# EAGLE design modem-breakout (EAGLE 9.6.2)
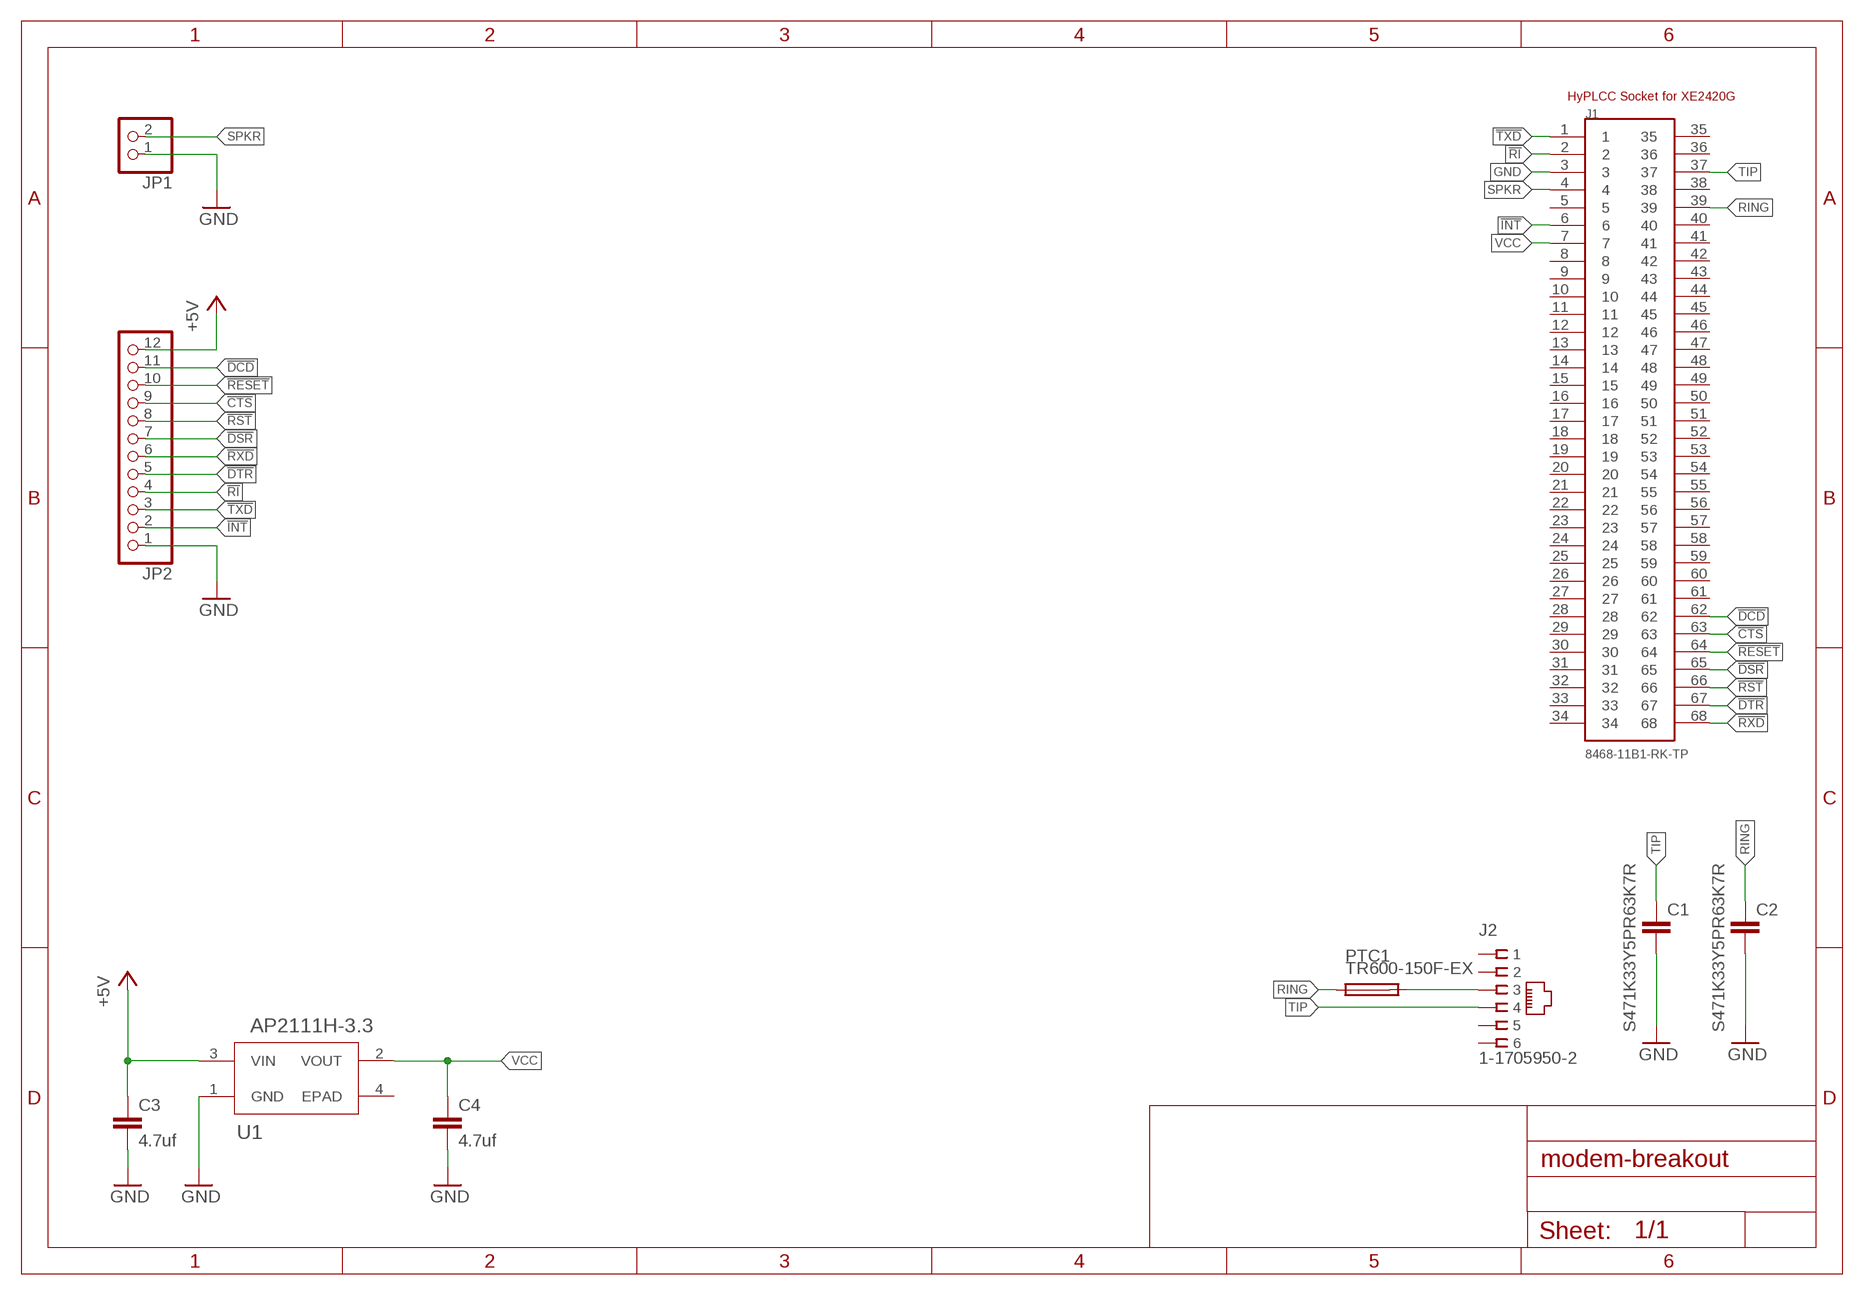
[diagram p0: schematic, sheet 1]

## Parts
C1  S471K33Y5PR63K7R  C-EU075-052X106  [C075-052X106]
C2  S471K33Y5PR63K7R  C-EU075-052X106  [C075-052X106]
C3  4.7uf  C-EUC0805  [C0805]
C4  4.7uf  C-EUC0805  [C0805]
J1  8468-11B1-RK-TP  [3M_8468-11B1-RK-TP]
J2  1-1705950-2  RJ11-2L-B  [RJ11-NO_SHIELD]
JP1  PINHD-1X2  [1X02]
JP2  PINHD-1X12  [1X12]
PTC1  TR600-150F-EX  [13.50X6.00]
U1  AP2111H-3.3  AP2111H-3.3TRG1SOT-223_DIO-M  [SOT-223_DIO-M]

## Nets
!CTS: J1.63 JP2.9
!DCD: J1.62 JP2.11
!DSR: J1.65 JP2.7
!DTR: J1.67 JP2.5
!INT: J1.6 JP2.2
!RESET: J1.64 JP2.10
!RI: J1.2 JP2.4
!RST: J1.66 JP2.8
!RXD: J1.68 JP2.6
!TXD: J1.1 JP2.3
+5V: C3.1 JP2.12 U1.3(VIN)
GND: C1.2 C2.2 C3.2 C4.2 J1.3 JP1.1 JP2.1 U1.1(GND)
N$3: J2.3 PTC1.P$2
RING: C2.1 J1.39 PTC1.P$1
SPKR: J1.4 JP1.2
TIP: C1.1 J1.37 J2.4
VCC: C4.1 J1.7 U1.2(VOUT)
Unconnected: J1.5 J1.8 J1.9 J1.10 J1.11 J1.12 J1.13 J1.14 J1.15 J1.16 J1.17 J1.18 J1.19 J1.20 J1.21 J1.22 J1.23 J1.24 J1.25 J1.26 J1.27 J1.28 J1.29 J1.30 J1.31 J1.32 J1.33 J1.34 J1.35 J1.36 J1.38 J1.40 J1.41 J1.42 J1.43 J1.44 J1.45 J1.46 J1.47 J1.48 J1.49 J1.50 J1.51 J1.52 J1.53 J1.54 J1.55 J1.56 J1.57 J1.58 J1.59 J1.60 J1.61 J2.1 J2.2 J2.5 J2.6 U1.4(EPAD)

## Notes on the sheet
- HyPLCC Socket for XE2420G

## Library data of the parts
C1-C4 = rcl:C-EU: CAPACITOR, European symbol; SPICEPREFIX: C
J1 = 8468-11B1-RK-TP:8468-11B1-RK-TP: PLCC Chip Carrier Socket (Low Profile, 4 Row, Thru-Hole) 68 position Check prices <https://pricing.snapeda.com/parts/8468-11B1-RK-TP/3M/view-part?ref=eda>; AVAILABILITY: In Stock; DESCRIPTION: 68 (4 x 17) Pos PLCC Socket Tin Through Hole; MF: 3M; MP: 8468-11B1-RK-TP; PACKAGE: None; PRICE: None; PURCHASE-URL: https://pricing.snapeda.com/search/part/8468-11B1-RK-TP/?ref=eda
J2 = con-tycoelectronics_copy:RJ11: CORCOM Modular RJ Jacks No Shield Source: www.tycoelectronics.com .. ENG_DS_1654001_1099_RJ_L_0507.pdf; MF: TYCO ELECTRONICS; MPN: RJ11-2L-B; OC_FARNELL: unknown; OC_NEWARK: 83F4463
JP1 = pinhead:PINHD-1X2: PIN HEADER
JP2 = pinhead:PINHD-1X12: PIN HEADER
PTC1 = TR600-150F-EX:TR600-150F-EX
U1 = AP2111H-3.3TRG1:AP2111H-3.3TRG1; BUILT_BY: EMA_UL_Team; MANUFACTURER_PART_NUMBER: AP2111H-3.3TRG1; SOURCELIBRARY: DIODESINC_2_2015-08-18; VENDOR: Diodes Inc

## Board
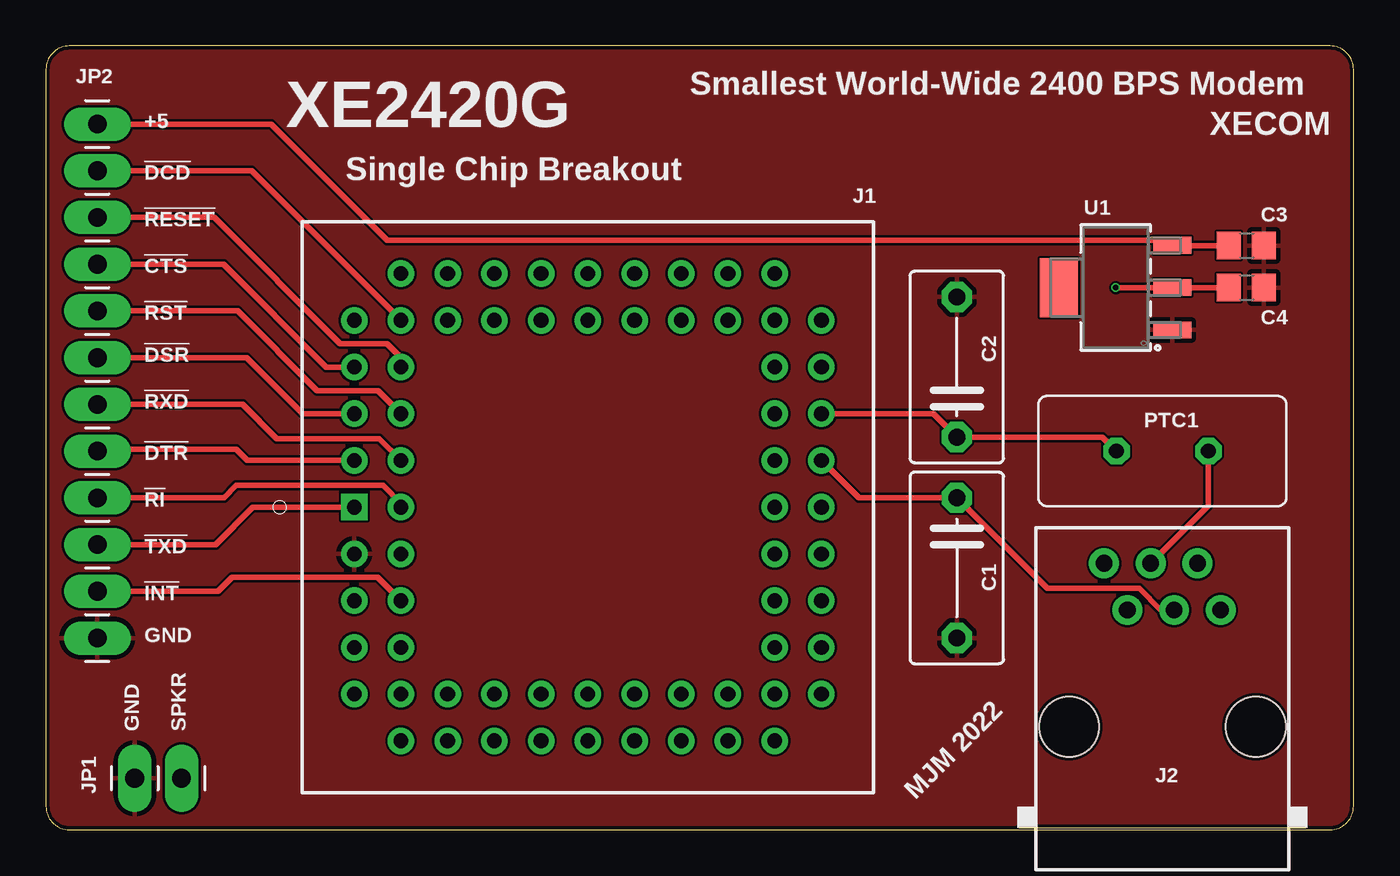
[diagram p1: board, top side]
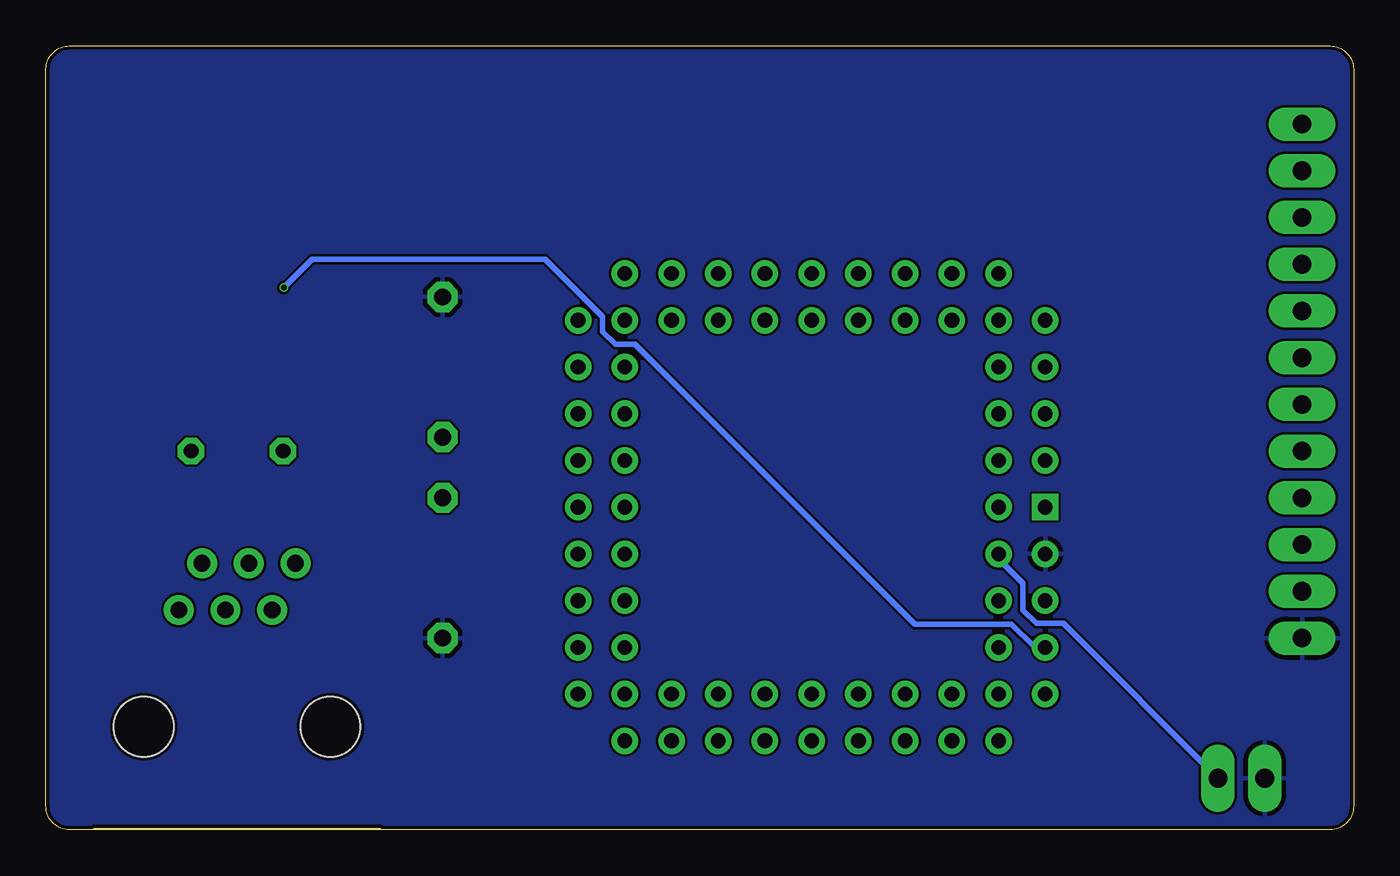
[diagram p2: board, bottom side, seen from below]

Size 71.1 x 42.6 mm. Coordinates in mm from the lower left corner, seen from the top.
Outline: 0,41.33 0,1.27 arc90 1.27,0 69.83,0 arc90 71.1,1.27 71.1,41.33 arc90 69.83,42.6 1.27,42.6 arc90 0,41.33
Copper layers (1*16): Top 0.035mm / dielectric 1.6mm / Bottom 0.035mm
Design rules "jlcpcb-2layers_tinted_vias": minimum track width 5mil, minimum drill 0.3mm, track to track 5mil, track to pad 5mil, pad to pad 5mil, via to via 5mil, smd to smd 5mil, copper to edge 0.2mm, drill to drill 6mil, minimum pad ring 10mil, minimum via ring 3mil, stop-mask expansion 4mil, vias tented up to drill 20mil, thermal gap 10mil

### Footprints (pad centres in the part's own frame; a part is rotated, then mirrored left to right if it is on the bottom)
C075-052X106 = drill 0.914 octagon: 1 -3.81,0; 2 3.81,0
C0805 = smd 1.3 x 1.5: 1 -0.95,0; 2 0.95,0
3M_8468-11B1-RK-TP = drill 0.8 pad 1.4 square: 1 0,12.7 | drill 0.8 pad 1.4: 2 0,10.16; 3 -2.54,12.7; 4 -2.54,10.16; 5 -5.08,12.7; 6 -5.08,10.16; 7 -7.62,12.7; 8 -7.62,10.16; 9 -10.16,12.7; 10 -12.7,10.16; 11 -10.16,10.16; 12 -12.7,7.62; 13 -10.16,7.62; 14 -12.7,5.08; 15 -10.16,5.08; 16 -12.7,2.54; 17 -10.16,2.54; 18 -12.7,0; 19 -10.16,0; 20 -12.7,-2.54; 21 -10.16,-2.54; 22 -12.7,-5.08; 23 -10.16,-5.08; 24 -12.7,-7.62; 25 -10.16,-7.62; 26 -12.7,-10.16; 27 -10.16,-12.7; 28 -10.16,-10.16; 29 -7.62,-12.7; 30 -7.62,-10.16; 31 -5.08,-12.7; 32 -5.08,-10.16; 33 -2.54,-12.7; 34 -2.54,-10.16; 35 0,-12.7; 36 0,-10.16; 37 2.54,-12.7; 38 2.54,-10.16; 39 5.08,-12.7; 40 5.08,-10.16; 41 7.62,-12.7; 42 7.62,-10.16; 43 10.16,-12.7; 44 12.7,-10.16; 45 10.16,-10.16; 46 12.7,-7.62; 47 10.16,-7.62; 48 12.7,-5.08; 49 10.16,-5.08; 50 12.7,-2.54; 51 10.16,-2.54; 52 12.7,0; 53 10.16,0; 54 12.7,2.54; 55 10.16,2.54; 56 12.7,5.08; 57 10.16,5.08; 58 12.7,7.62; 59 10.16,7.62; 60 12.7,10.16; 61 10.16,12.7; 62 10.16,10.16; 63 7.62,12.7; 64 7.62,10.16; 65 5.08,12.7; 66 5.08,10.16; 67 2.54,12.7; 68 2.54,10.16
RJ11-NO_SHIELD = drill 0.9 pad 1.4: 1 -3.175,8.89; 2 -1.905,6.35; 3 -0.635,8.89; 4 0.635,6.35; 5 1.905,8.89; 6 3.175,6.35 | hole 3.251: -5.08,0; 5.08,0
1X02 = drill 1.016 long: 1 -1.27,0; 2 1.27,0
1X12 = drill 1.016 long: 1 -13.97,0; 2 -11.43,0; 3 -8.89,0; 4 -6.35,0; 5 -3.81,0; 6 -1.27,0; 7 1.27,0; 8 3.81,0; 9 6.35,0; 10 8.89,0; 11 11.43,0; 12 13.97,0
13.50X6.00 = drill 0.8 octagon: P$1 -2.5,0; P$2 2.5,0
SOT-223_DIO-M = smd 0.902 x 2.066: 1 -2.3,-3.076; 2 0,-3.076; 3 2.3,-3.076 | smd 3.202 x 2.066: 4 0,3.076

### Placement (x,y rotation side)
C1  49.53,14.22 270 top
C2  49.53,25.15 90 top
C3  65.28,31.75 0 top
C4  65.28,29.46 0 top
J1  29.46,17.53 90 top
J2  60.71,5.59 0 top
JP1  6.1,2.79 0 top
JP2  2.79,24.38 90 top
PTC1  60.71,20.57 0 top
U1  58.17,29.46 90 top

### Tracks (layer width: path | path; a pad name or v marks a point on that pad's centre or on a via)
!CTS
  Top 0.305: JP2.9 9.65,30.73 15.24,25.15 J1.63
!DCD
  Top 0.305: JP2.11 11.18,35.81 J1.62
!DSR
  Top 0.305: JP2.7 10.92,25.65 13.97,22.61 J1.65
!DTR
  Top 0.305: JP2.5 2.9,20.68 10.34,20.68 10.95,20.07 J1.67
!INT
  Top 0.305: JP2.2 9.37,12.95 10.13,13.72 18.03,13.72 J1.6
!RESET
  Top 0.305: JP2.10 9.14,33.27 16,26.42 18.54,26.42 19.3,25.65 J1.64
!RI
  Top 0.305: JP2.4 9.68,18.03 10.35,18.71 18.32,18.71 19.3,17.73 J1.2
!RST
  Top 0.305: JP2.8 10.41,28.19 14.76,23.85 18.06,23.85 J1.66
!RXD
  Top 0.305: JP2.6 10.69,23.11 12.55,21.26 18.11,21.26 J1.68
!TXD
  Top 0.305: JP2.3 9.22,15.49 11.25,17.53 J1.1
+5V
  Top 0.305: C3.1 61.26,31.75 U1.3 60.96,32.04 18.54,32.04 12.23,38.35 JP2.12
GND
  pour Top: -2.54,45.72 73.66,45.72 73.66,-3.81 -2.54,-3.81
  pour Bottom: 73.66,45.72 -2.54,45.72 -2.54,-3.81 73.66,-3.81
N$3
  Top 0.305: PTC1.P$2 63.21,17.61 J2.3
RING
  Top 0.305: PTC1.P$1 57.44,21.34 C2.1 48.26,22.61 J1.39
SPKR
  Bottom 0.305: J1.4 19.3,14.73 17.97,13.4 17.97,11.93 17.25,11.21 15.79,11.21 JP1.2
TIP
  Top 0.305: J2.4 60.63,11.94 59.44,13.12 54.44,13.12 C1.1 44.2,18.03 J1.37
VCC  (via drill 0.3)
  Top 0.305: C4.1 U1.2 v58.17,29.46
  Bottom 0.305: J1.7 17.34,9.91 18.59,11.16 23.86,11.16 39.08,26.38 40.13,26.38 40.83,27.07 40.83,27.87 43.97,31.01 56.62,31.01 v58.17,29.46

### Text on the board
tPlace: Smallest World-Wide 2400 BPS Modem | +5 | XE2420G | XECOM | !DCD | Single Chip Breakout | !RESET | !CTS | !RST | !DSR | !RXD | !DTR | !RI | !TXD | !INT | GND | GND | SPKR | MJM 2022